# EasyEDA Pro project ProPrj_BS4C_00006_03_EasyEDA_2025-07-22.epro

# Schematic Schematic1
Board Name: Board1; Create Date: 2025-07-20; Page Name: P1; Project Name: BS4C_00006_03_EasyEDA; Schematic Name: Schematic1; Update Date: 2025-07-20; Company: evyos.com.tr; Page Size: A4; Version: V1.0
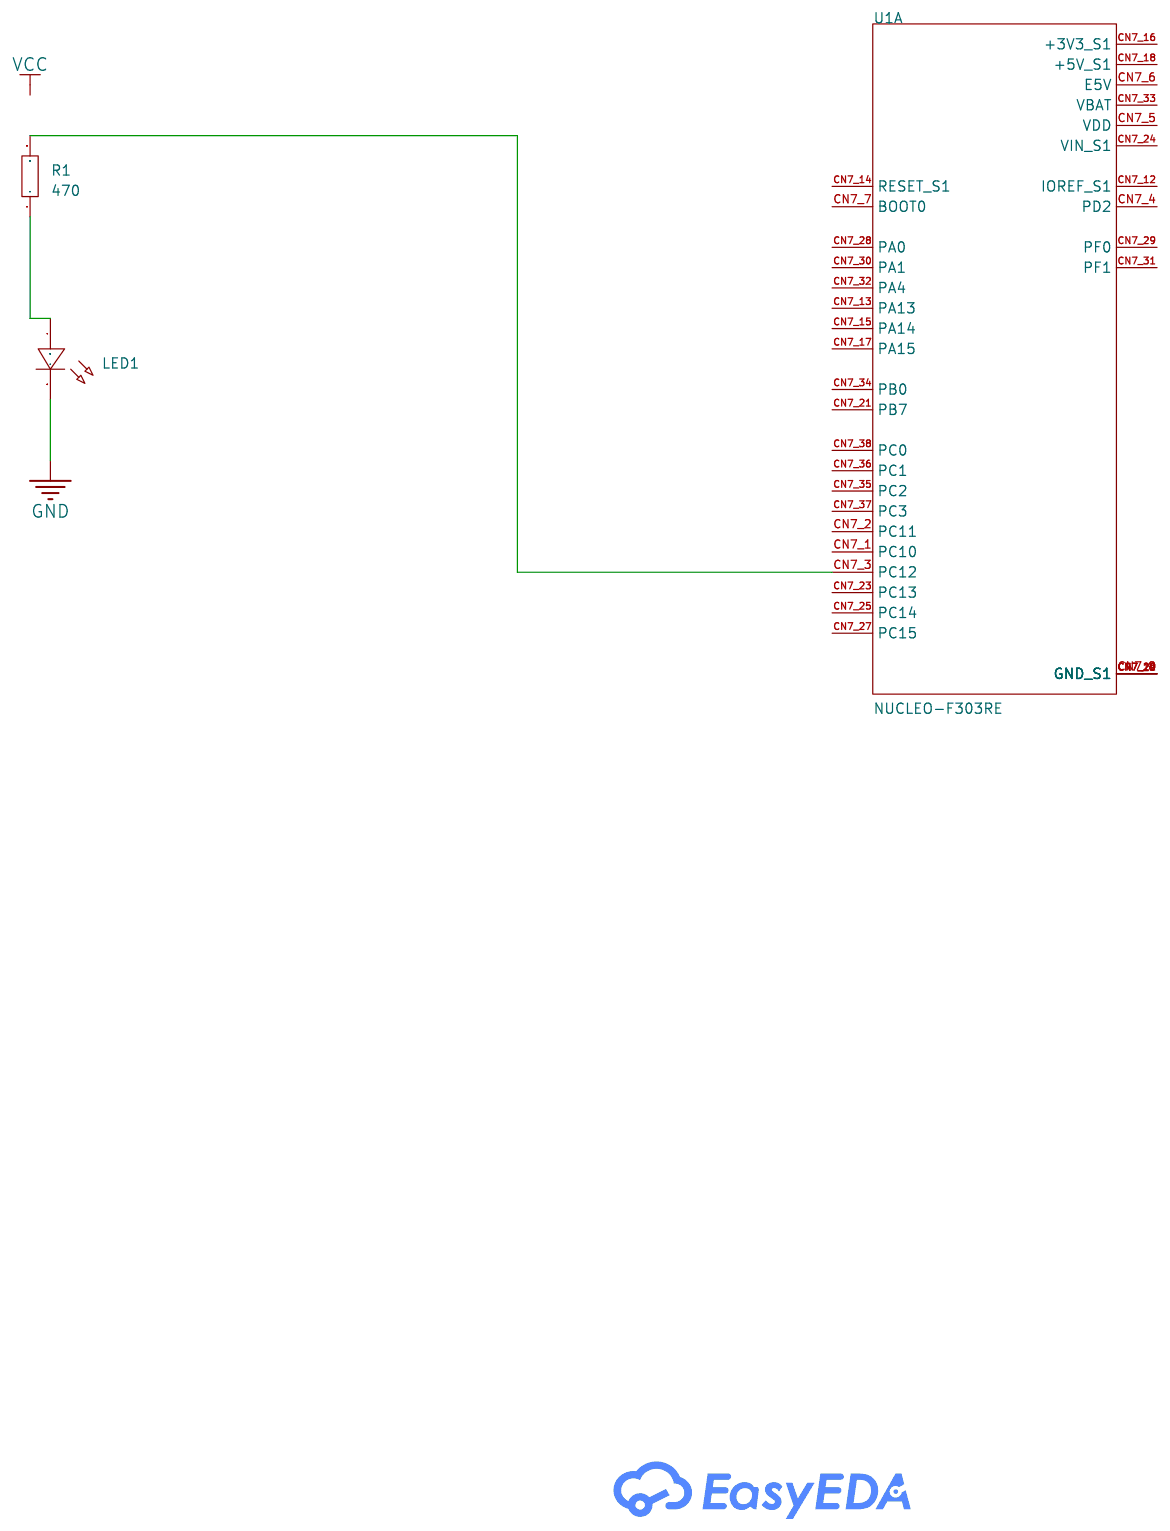
[diagram p0: schematic sheet]

## Parts
LED1  -  [LED-TH_BD3.0-P2.54-FD]
R1  470  [RES-TH_BD1.8-L3.2-P7.20-D0.4]
U1  NUCLEO-F303RE  (section 1)

## Library data of the parts
LED1 = LED_TH-R_3mm: Supplier Footprint: Through
R1 = Res_AXIAL-1/8W: Supplier Footprint: Through
U1 = NUCLEO-F303RE

## Nets
GND: LED1.2(A)
Net-(LED1-1): LED1.1(C) R1.1
Net-(R1-2): R1.2 U1.CN7_3(PC12)
Net-(U1-CN7_8): U1.CN7_8(GND_S1) U1.CN7_19(GND_S1) U1.CN7_20(GND_S1) U1.CN7_22(GND_S1)

Not connected (* = marked no-connect by the designer): U1 CN7_1(PC10) CN7_2(PC11) CN7_4(PD2) CN7_5(VDD) CN7_6(E5V) CN7_7(BOOT0) CN7_12(IOREF_S1) CN7_13(PA13) CN7_14(RESET_S1) CN7_15(PA14) CN7_16(+3V3_S1) CN7_17(PA15) CN7_18(+5V_S1) CN7_21(PB7) CN7_23(PC13) CN7_24(VIN_S1) CN7_25(PC14) CN7_27(PC15) CN7_28(PA0) CN7_29(PF0) CN7_30(PA1) CN7_31(PF1) CN7_32(PA4) CN7_33(VBAT) CN7_34(PB0) CN7_35(PC2) CN7_36(PC1) CN7_37(PC3) CN7_38(PC0)
